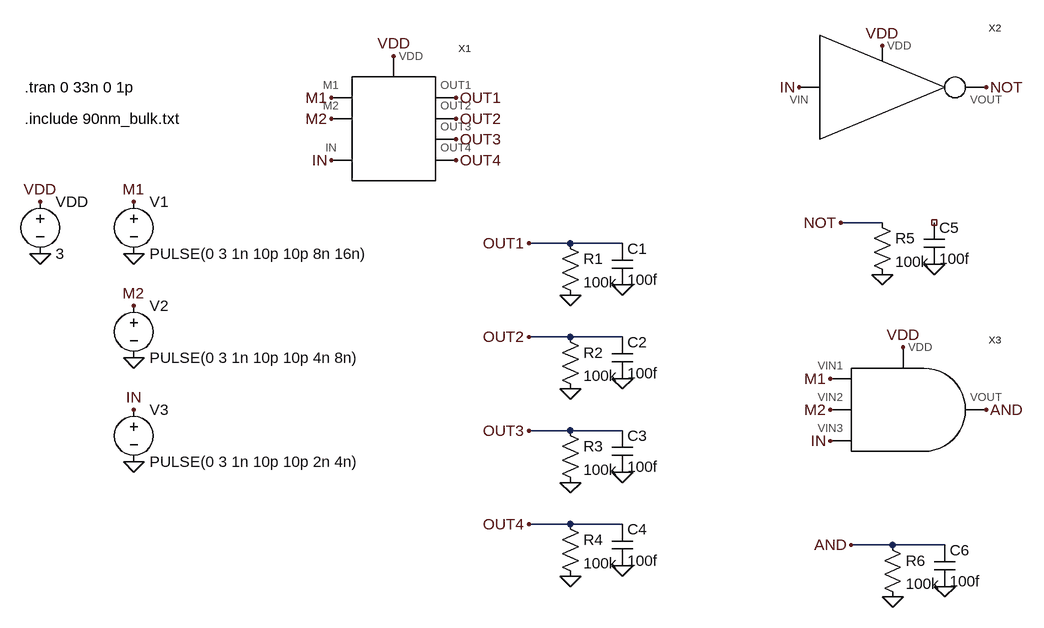
[diagram p0: schematic test.asc]
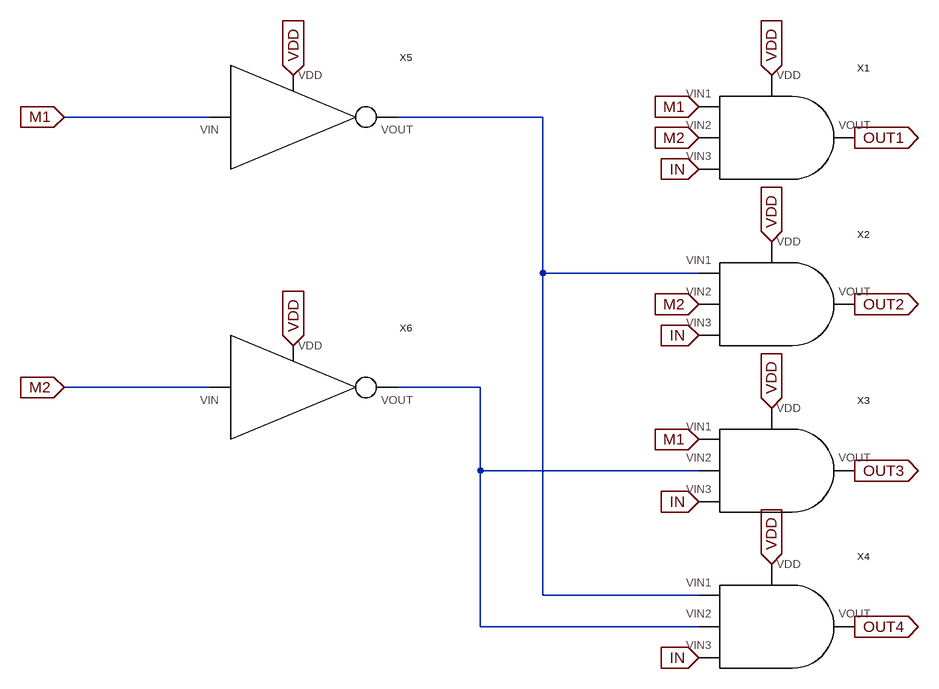
[diagram p1: sub-circuit demultiplexer.asc]
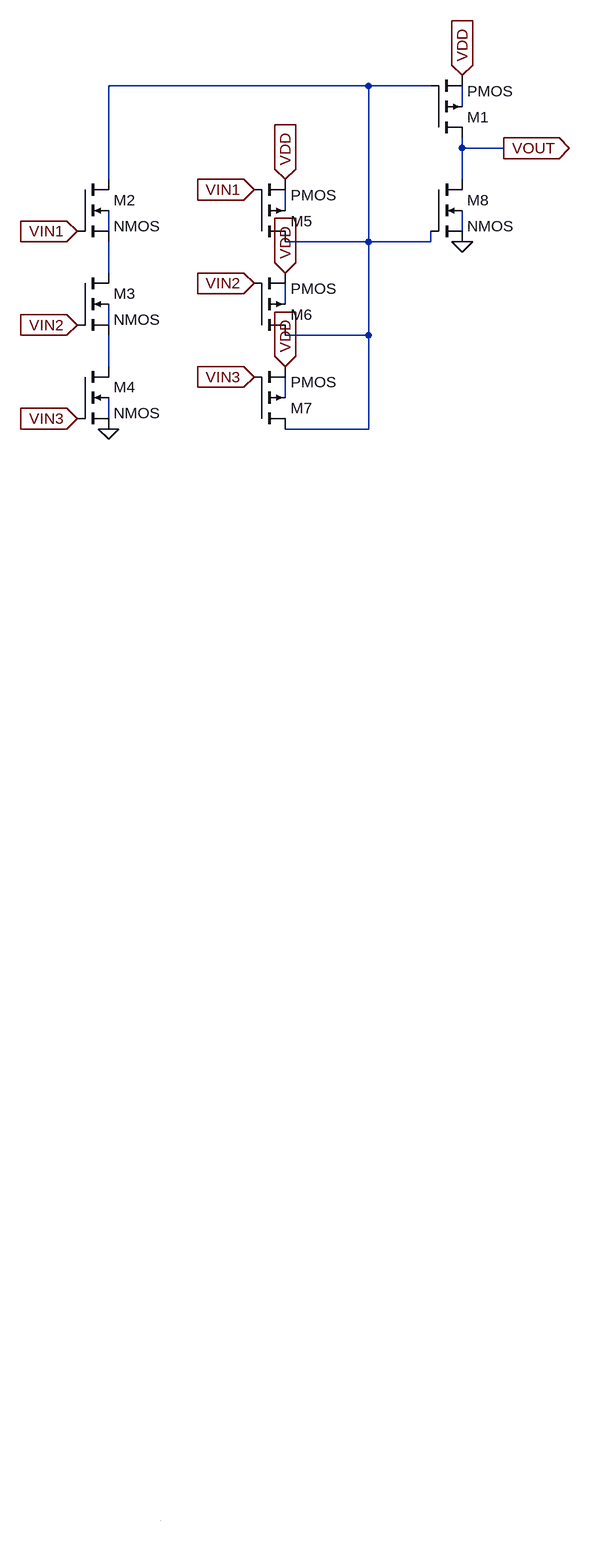
[diagram p2: sub-circuit and3.asc]
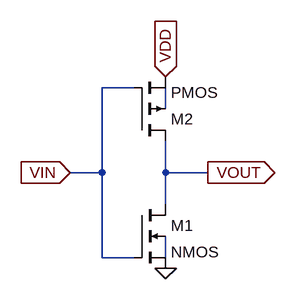
[diagram p3: sub-circuit not.asc]
test.asc, the LTspice schematic file:
Version 4
SHEET 1 2180 1108
WIRE 1008 448 944 448
WIRE 528 480 464 480
WIRE 608 480 528 480
WIRE 528 624 464 624
WIRE 608 624 528 624
WIRE 528 768 464 768
WIRE 608 768 528 768
WIRE 528 912 464 912
WIRE 608 912 528 912
WIRE 1024 944 960 944
WIRE 1104 944 1024 944
FLAG -288 496 0
FLAG -288 416 VDD
FLAG 256 192 VDD
FLAG -144 496 0
FLAG -144 656 0
FLAG -144 816 0
FLAG -144 416 M1
FLAG 160 256 M1
FLAG -144 576 M2
FLAG 160 288 M2
FLAG -144 736 IN
FLAG 160 352 IN
FLAG 528 560 0
FLAG 608 544 0
FLAG 528 704 0
FLAG 608 688 0
FLAG 528 848 0
FLAG 608 832 0
FLAG 528 992 0
FLAG 608 976 0
FLAG 464 480 OUT1
FLAG 352 256 OUT1
FLAG 464 624 OUT2
FLAG 352 288 OUT2
FLAG 352 320 OUT3
FLAG 464 768 OUT3
FLAG 464 912 OUT4
FLAG 352 352 OUT4
FLAG 928 688 M1
FLAG 928 736 M2
FLAG 928 784 IN
FLAG 880 240 IN
FLAG 1008 176 VDD
FLAG 1040 640 VDD
FLAG 1008 528 0
FLAG 1088 512 0
FLAG 944 448 NOT
FLAG 1024 1024 0
FLAG 1104 1008 0
FLAG 960 944 AND
FLAG 1168 240 NOT
FLAG 1168 736 AND
SYMBOL demultiplexer 256 304 R0
SYMATTR InstName X1
SYMBOL voltage -144 400 R0
WINDOW 123 0 0 Left 0
WINDOW 39 0 0 Left 0
SYMATTR InstName V1
SYMATTR Value PULSE(0 3 1n 10p 10p 8n 16n)
SYMBOL voltage -144 560 R0
WINDOW 123 0 0 Left 0
WINDOW 39 0 0 Left 0
SYMATTR InstName V2
SYMATTR Value PULSE(0 3 1n 10p 10p 4n 8n)
SYMBOL voltage -144 720 R0
WINDOW 123 0 0 Left 0
WINDOW 39 0 0 Left 0
SYMATTR InstName V3
SYMATTR Value PULSE(0 3 1n 10p 10p 2n 4n)
SYMBOL voltage -288 400 R0
WINDOW 123 0 0 Left 0
WINDOW 39 0 0 Left 0
SYMATTR InstName VDD
SYMATTR Value 3
SYMBOL res 512 464 R0
SYMATTR InstName R1
SYMATTR Value 100k
SYMBOL cap 592 480 R0
SYMATTR InstName C1
SYMATTR Value 100f
SYMBOL cap 592 624 R0
SYMATTR InstName C2
SYMATTR Value 100f
SYMBOL cap 592 768 R0
SYMATTR InstName C3
SYMATTR Value 100f
SYMBOL cap 592 912 R0
SYMATTR InstName C4
SYMATTR Value 100f
SYMBOL res 512 608 R0
SYMATTR InstName R2
SYMATTR Value 100k
SYMBOL res 512 752 R0
SYMATTR InstName R3
SYMATTR Value 100k
SYMBOL res 512 896 R0
SYMATTR InstName R4
SYMATTR Value 100k
SYMBOL not 1008 240 R0
SYMATTR InstName X2
SYMBOL and3 1040 736 R0
SYMATTR InstName X3
SYMBOL res 992 432 R0
SYMATTR InstName R5
SYMATTR Value 100k
SYMBOL cap 1072 448 R0
SYMATTR InstName C5
SYMATTR Value 100f
SYMBOL res 1008 928 R0
SYMATTR InstName R6
SYMATTR Value 100k
SYMBOL cap 1088 944 R0
SYMATTR InstName C6
SYMATTR Value 100f
TEXT -312 288 Left 2 !.include 90nm_bulk.txt
TEXT -312 240 Left 2 !.tran 0 33n 0 1p

demultiplexer.asc, the sub-circuit schematic file:
Version 4
SHEET 1 1080 680
WIRE -1040 -320 -1264 -320
WIRE -528 -320 -752 -320
WIRE -528 -80 -528 -320
WIRE -288 -80 -528 -80
WIRE -1040 96 -1264 96
WIRE -624 96 -752 96
WIRE -624 224 -624 96
WIRE -288 224 -624 224
WIRE -528 416 -528 -80
WIRE -288 416 -528 416
WIRE -624 464 -624 224
WIRE -288 464 -624 464
FLAG -176 -384 VDD
IOPIN -176 -384 In
FLAG -176 -128 VDD
IOPIN -176 -128 In
FLAG -176 128 VDD
IOPIN -176 128 In
FLAG -176 368 VDD
IOPIN -176 368 In
FLAG -912 32 VDD
IOPIN -912 32 In
FLAG -912 -384 VDD
IOPIN -912 -384 In
FLAG -1264 -320 M1
IOPIN -1264 -320 In
FLAG -288 -336 M1
IOPIN -288 -336 In
FLAG -288 176 M1
IOPIN -288 176 In
FLAG -1264 96 M2
IOPIN -1264 96 In
FLAG -288 -288 M2
IOPIN -288 -288 In
FLAG -288 -32 M2
IOPIN -288 -32 In
FLAG -288 512 IN
IOPIN -288 512 In
FLAG -288 272 IN
IOPIN -288 272 In
FLAG -288 16 IN
IOPIN -288 16 In
FLAG -288 -240 IN
IOPIN -288 -240 In
FLAG -48 -288 OUT1
IOPIN -48 -288 Out
FLAG -48 -32 OUT2
IOPIN -48 -32 Out
FLAG -48 224 OUT3
IOPIN -48 224 Out
FLAG -48 464 OUT4
IOPIN -48 464 Out
SYMBOL and3 -176 -288 R0
SYMATTR InstName X1
SYMBOL and3 -176 -32 R0
SYMATTR InstName X2
SYMBOL and3 -176 224 R0
SYMATTR InstName X3
SYMBOL and3 -176 464 R0
SYMATTR InstName X4
SYMBOL not -912 -320 R0
SYMATTR InstName X5
SYMBOL not -912 96 R0
SYMATTR InstName X6

and3.asc, the sub-circuit schematic file:
Version 4
SHEET 1 880 680
WIRE 320 -2208 -80 -2208
WIRE 416 -2208 320 -2208
WIRE 464 -2176 464 -2208
WIRE 464 -2112 464 -2128
WIRE 528 -2112 464 -2112
WIRE -80 -2064 -80 -2208
WIRE 464 -2064 464 -2112
WIRE 192 -2016 192 -2048
WIRE -80 -1984 -80 -2016
WIRE 464 -1984 464 -2016
WIRE 320 -1968 320 -2208
WIRE 320 -1968 192 -1968
WIRE 416 -1968 416 -1984
WIRE 416 -1968 320 -1968
WIRE -80 -1920 -80 -1968
WIRE 192 -1872 192 -1904
WIRE -80 -1840 -80 -1872
WIRE 320 -1824 320 -1968
WIRE 320 -1824 192 -1824
WIRE -80 -1776 -80 -1824
WIRE 192 -1728 192 -1760
WIRE -80 -1696 -80 -1728
WIRE 320 -1680 320 -1824
WIRE 320 -1680 192 -1680
WIRE 0 0 0 0
FLAG -80 -1680 0
FLAG -128 -1984 VIN1
IOPIN -128 -1984 In
FLAG -128 -1840 VIN2
IOPIN -128 -1840 In
FLAG -128 -1696 VIN3
IOPIN -128 -1696 In
FLAG 464 -2224 VDD
IOPIN 464 -2224 In
FLAG 528 -2112 VOUT
IOPIN 528 -2112 Out
FLAG 464 -1968 0
FLAG 144 -2048 VIN1
IOPIN 144 -2048 In
FLAG 144 -1904 VIN2
IOPIN 144 -1904 In
FLAG 144 -1760 VIN3
IOPIN 144 -1760 In
FLAG 192 -2064 VDD
IOPIN 192 -2064 In
FLAG 192 -1920 VDD
IOPIN 192 -1920 In
FLAG 192 -1776 VDD
IOPIN 192 -1776 In
SYMBOL nmos4 -128 -2064 R0
SYMATTR InstName M2
SYMATTR Value2 l=90n w=200n
SYMBOL nmos4 -128 -1920 R0
SYMATTR InstName M3
SYMATTR Value2 l=90n w=200n
SYMBOL nmos4 -128 -1776 R0
SYMATTR InstName M4
SYMATTR Value2 l=90n w=200n
SYMBOL pmos4 416 -2128 M180
SYMATTR InstName M1
SYMATTR Value2 l=90n w=400n
SYMBOL pmos4 144 -1968 M180
SYMATTR InstName M5
SYMATTR Value2 l=90n w=400n
SYMBOL pmos4 144 -1824 M180
SYMATTR InstName M6
SYMATTR Value2 l=90n w=400n
SYMBOL pmos4 144 -1680 M180
SYMATTR InstName M7
SYMATTR Value2 l=90n w=400n
SYMBOL nmos4 416 -2064 R0
SYMATTR InstName M8
SYMATTR Value2 l=90n w=200n

not.asc, the sub-circuit schematic file:
Version 4
SHEET 1 1208 680
WIRE 640 80 592 80
WIRE 688 112 688 80
WIRE 592 208 592 80
WIRE 592 208 544 208
WIRE 688 208 688 160
WIRE 752 208 688 208
WIRE 688 256 688 208
WIRE 592 336 592 208
WIRE 640 336 592 336
WIRE 688 336 688 304
FLAG 544 208 VIN
IOPIN 544 208 In
FLAG 752 208 VOUT
IOPIN 752 208 Out
FLAG 688 352 0
FLAG 688 64 VDD
IOPIN 688 64 In
SYMBOL nmos4 640 256 R0
SYMATTR InstName M1
SYMATTR Value2 l=90n w=200n
SYMBOL pmos4 640 160 M180
SYMATTR InstName M2
SYMATTR Value2 l=90n w=400n

The netlist it stands for:
* test.asc
XX1 VDD OUT1 OUT2 OUT3 OUT4 M1 M2 IN demultiplexer
V1 M1 0 PULSE(0 3 1n 10p 10p 8n 16n)
V2 M2 0 PULSE(0 3 1n 10p 10p 4n 8n)
V3 IN 0 PULSE(0 3 1n 10p 10p 2n 4n)
VDD VDD 0 3
R1 OUT1 0 100k
C1 OUT1 0 100f
C2 OUT2 0 100f
C3 OUT3 0 100f
C4 OUT4 0 100f
R2 OUT2 0 100k
R3 OUT3 0 100k
R4 OUT4 0 100k
XX2 VDD IN NOT not
XX3 M1 M2 IN VDD AND and3
R5 NOT 0 100k
C5 NC_01 0 100f
R6 AND 0 100k
C6 AND 0 100f

* block symbol definitions
.subckt demultiplexer VDD OUT1 OUT2 OUT3 OUT4 M1 M2 IN
XX1 M1 M2 IN VDD OUT1 and3
XX2 N001 M2 IN VDD OUT2 and3
XX3 M1 N002 IN VDD OUT3 and3
XX4 N001 N002 IN VDD OUT4 and3
XX5 VDD M1 N001 not
XX6 VDD M2 N002 not
.ends demultiplexer

.subckt and3 VIN1 VIN2 VIN3 VDD VOUT
M2 N001 VIN1 N006 N004 NMOS l=90n w=200n
M3 N006 VIN2 N009 N008 NMOS l=90n w=200n
M4 N009 VIN3 0 N011 NMOS l=90n w=200n
M1 VOUT N001 VDD N002 PMOS l=90n w=400n
M5 N001 VIN1 VDD N003 PMOS l=90n w=400n
M6 N001 VIN2 VDD N007 PMOS l=90n w=400n
M7 N001 VIN3 VDD N010 PMOS l=90n w=400n
M8 VOUT N001 0 N005 NMOS l=90n w=200n
.ends and3

.subckt not VDD VIN VOUT
M1 VOUT VIN 0 N002 NMOS l=90n w=200n
M2 VOUT VIN VDD N001 PMOS l=90n w=400n
.ends not

.model NMOS NMOS
.model PMOS PMOS
.lib standard.mos
.include 90nm_bulk.txt
.tran 0 33n 0 1p
.backanno
.end

* Results of the author's LTspice run, read from the files saved beside the schematic
* Operating Point, zero values left out:
*   V(out1) = 540.1 mV
*   V(vdd) = 3 V
*   V(out2) = 537.1 mV
*   V(out3) = 540.9 mV
*   V(out4) = 536.5 mV
*   V(not) = 2.494 V
*   V(and) = 540.1 mV
*   I(R6) = 5.401 µA
*   I(R5) = 24.94 µA
*   I(R4) = 5.365 µA
*   I(R3) = 5.409 µA
*   I(R2) = 5.371 µA
*   I(R1) = 5.401 µA
*   I(Vdd) = -3.521 mA
*   I(V3) = 278.7 µA
*   I(V2) = 190.1 µA
*   I(V1) = 203.6 µA
*   Ix(x1:VDD) = 2.637 mA
*   Ix(x1:OUT1) = -5.401 µA
*   Ix(x1:OUT2) = -5.371 µA
*   Ix(x1:OUT3) = -5.409 µA
*   Ix(x1:OUT4) = -5.365 µA
*   Ix(x1:M1) = -154.6 µA
*   Ix(x1:M2) = -145.7 µA
*   Ix(x1:IN) = -177.2 µA
*   Ix(x2:VDD) = 353.4 µA
*   Ix(x2:VIN) = -57.2 µA
*   Ix(x2:VOUT) = -24.94 µA
*   Ix(x3:VIN1) = -48.93 µA
*   Ix(x3:VIN2) = -44.47 µA
*   Ix(x3:VIN3) = -44.31 µA
*   Ix(x3:VDD) = 530.2 µA
*   Ix(x3:VOUT) = -5.401 µA
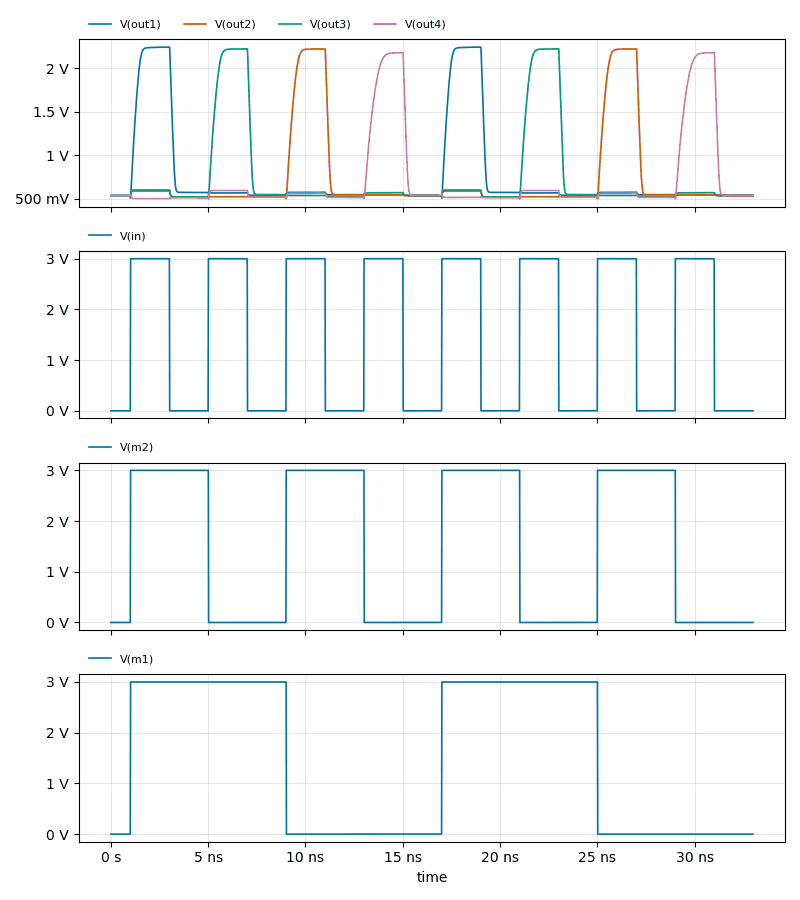
[diagram p4: Transient Analysis of test.asc, plotted from the saved traces]
* Transient Analysis, 1 run:
*   V(out1): min 509.5 mV, max 2.245 V, average 750 mV, rms 909.5 mV, last 540.1 mV
*   V(out2): min 503.6 mV, max 2.225 V, average 732.2 mV, rms 888 mV, last 537.7 mV
*   V(out3): min 510.8 mV, max 2.225 V, average 736.2 mV, rms 890.5 mV, last 542.6 mV
*   V(out4): min 497.7 mV, max 2.18 V, average 710.9 mV, rms 852.5 mV, last 542.2 mV
*   V(in): min 0 V, max 3 V, average 1.462 V, rms 2.092 V, last 0 V
*   V(m2): min 0 V, max 3 V, average 1.458 V, rms 2.091 V, last 0 V
*   V(m1): min 0 V, max 3 V, average 1.456 V, rms 2.09 V, last 0 V